# Altium schematic sheet Arduino_SLVN.SchDoc: Arduino-SLVN
size A4; Date: no entry; ApprovedBy: no entry; CheckedBy: no entry; Author: mattmue; CompanyName: ETH Zürich; DrawnBy: no entry; Engineer: no entry; Organization: ETH Zürich; Address1: Robotic Systems Lab; Address2: Leonhardstrasse 21; Address3: 8092 Zürich; Address4: Swizerland; DocumentNumber: no entry; Revision: 01; SheetNumber: 1; SheetTotal: 2; Time: no entry; ImagePath: no entry; Application_BuildNumber: no entry
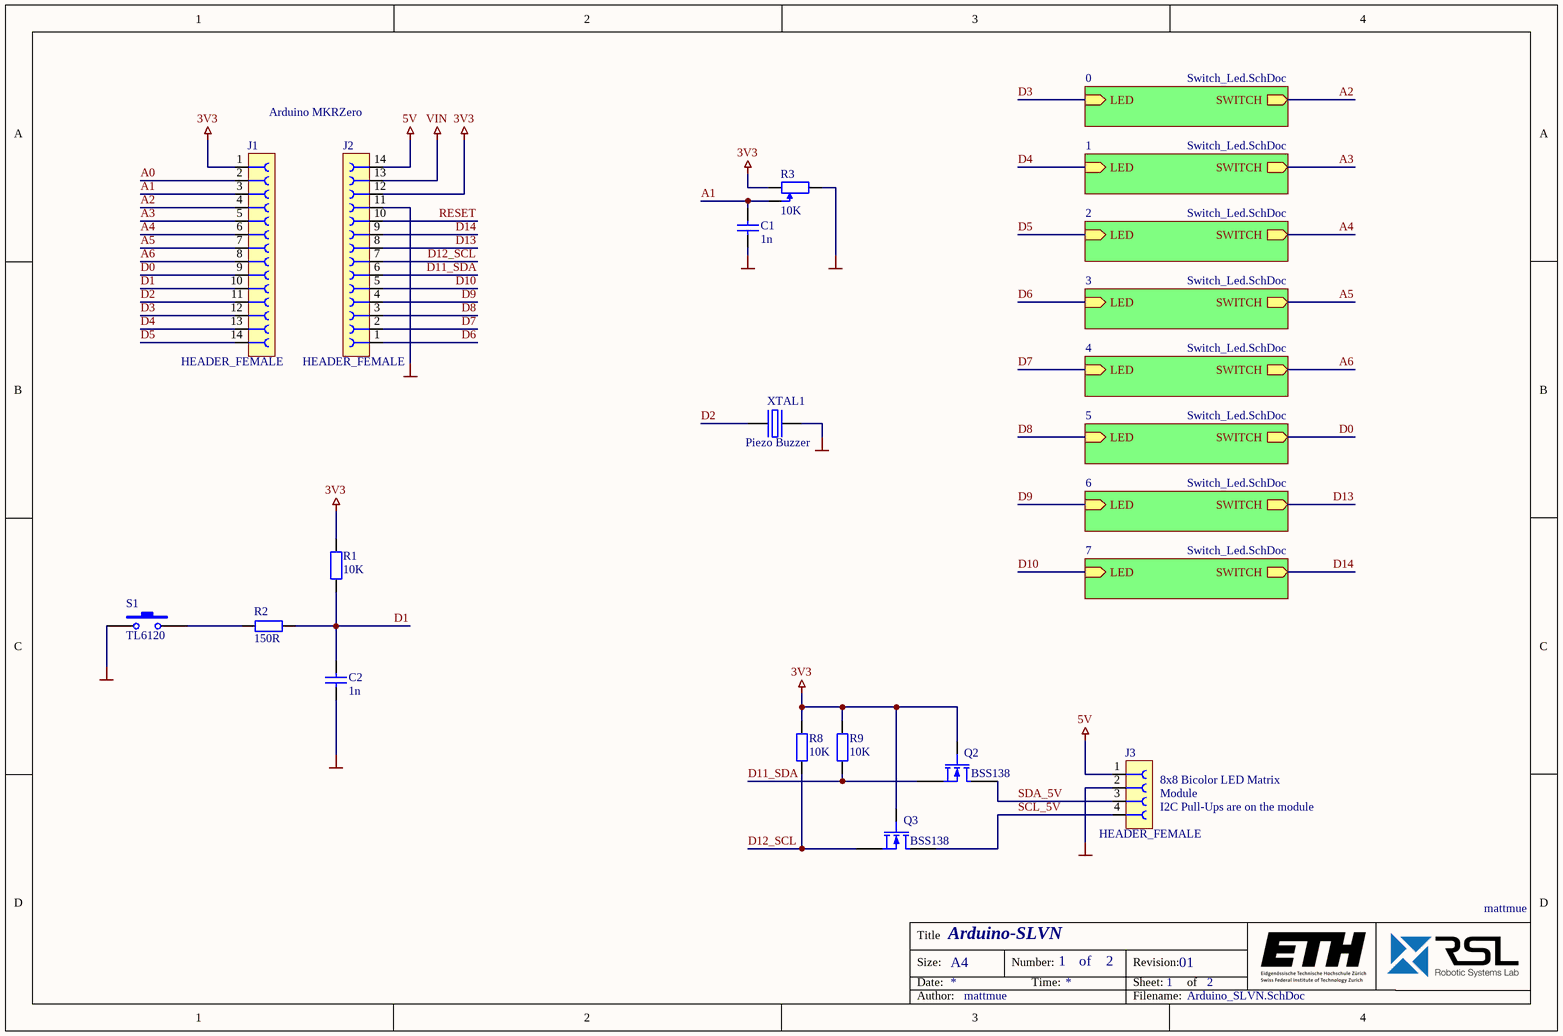
[diagram p0: Arduino_SLVN.SchDoc]

## Parts
C1  value 1n  [SMD_CAPC1608X08N]  (hidden comment: C0603)
C2  value 1n  [SMD_CAPC1608X08N]  (hidden comment: C0603)
J1  HEADER_FEMALE  [THT_CONN_1x14_FEMALE_2.54]
J2  HEADER_FEMALE  [THT_CONN_1x14_FEMALE_2.54]
J3  HEADER_FEMALE  [THT_CONN_1x4_FEMALE_2.54]
Q2  BSS138  [SOT323 SC70]
Q3  BSS138  [SOT323 SC70]
R1  value 10K  [SMD_RESC1608X05N]  (hidden comment: R0603)
R2  value 150R  [SMD_RESC1608X05N]  (hidden comment: R0603)
R3  value 10K  [THT_PTV09A-1]  (hidden comment: PTV09A-4020S-B103)
R8  value 10K  [SMD_RESC1608X05N]  (hidden comment: R0603)
R9  value 10K  [SMD_RESC1608X05N]  (hidden comment: R0603)
S1  TL6120  [SMD_TL6120]
sdfg1  Mattmue-Logo  [GRAPH_MATTMUE_6MM]  (value not drawn)  (no BOM)
XTAL1  Note: Piezo Buzzer  [THT_PIEZO_5mm]  (hidden comment: PS1240P02BT)

## Sub-sheets
0 = Switch_Led.SchDoc: LED (in), SWITCH (out)
1 = Switch_Led.SchDoc: LED (in), SWITCH (out)
2 = Switch_Led.SchDoc: LED (in), SWITCH (out)
3 = Switch_Led.SchDoc: LED (in), SWITCH (out)
4 = Switch_Led.SchDoc: LED (in), SWITCH (out)
5 = Switch_Led.SchDoc: LED (in), SWITCH (out)
6 = Switch_Led.SchDoc: LED (in), SWITCH (out)
7 = Switch_Led.SchDoc: LED (in), SWITCH (out)

## Nets
3V3: J1.1 J2.12 Q2.1(G) Q3.1(G) R1.2 R3.1 R8.2 R9.2
5V: J2.14 J3.1
GND: C1.1 C2.1 J2.11 J3.2 R3.2 S1.1 XTAL1.2
VIN: J2.13
A0: J1.2
A1: C1.2 J1.3 R3.3(TAP)
A2: J1.4 ; sheet 0/SWITCH
A3: J1.5 ; sheet 1/SWITCH
A4: J1.6 ; sheet 2/SWITCH
A5: J1.7 ; sheet 3/SWITCH
A6: J1.8 ; sheet 4/SWITCH
D0: J1.9 ; sheet 5/SWITCH
D1: C2.2 J1.10 R1.1 R2.1
D2: J1.11 XTAL1.1
D3: J1.12 ; sheet 0/LED
D4: J1.13 ; sheet 1/LED
D5: J1.14 ; sheet 2/LED
D6: J2.1 ; sheet 3/LED
D7: J2.2 ; sheet 4/LED
D8: J2.3 ; sheet 5/LED
D9: J2.4 ; sheet 6/LED
D10: J2.5 ; sheet 7/LED
D11_SDA: J2.6 Q2.2(S) R9.1
D12_SCL: J2.7 Q3.2(S) R8.1
D13: J2.8 ; sheet 6/SWITCH
D14: J2.9 ; sheet 7/SWITCH
RESET: J2.10
SCL_5V: J3.4 Q3.3(D)
SDA_5V: J3.3 Q2.3(D)
NetR2_2: R2.2 S1.2

## Notes on the sheet
- Arduino MKRZero
- (near J3) 8x8 Bicolor LED Matrix
- (near J3) I2C Pull-Ups are on the module
- (near J3) Module
- Title
- Size:
- Date:
- A4
- Number:
- Time:
- of
- Revision:
- Sheet:
- Author:
- Filename:
- (in symbol CMPL-001-0415-A.3) mattmue

## Library data of the parts
C1 C2 = CMP-02314-1: CERCAP 1n 100V 1% NP0/C0G 0603; Manufacturer: KEMET; Manufacturer Part Number: C0603C102F1GAC7867; Supplier: Digi-Key; Supplier Part Number: 399-17967-1-ND
J1 J2 = CMP-02128-2: CONN Female 1x14 2.54mm Straight THT 2.54x35.6mm; Manufacturer: Sullins Connector Solutions; Manufacturer Part Number: PPTC141LFBN-RC; Supplier Part Number: S7012-ND; Supplier: Digi-Key
J3 = CMP-02129-1: CONN Female 1x4 2.54mm Straight THT 2.54x10.16mm; Manufacturer: Sullins Connector Solutions; Manufacturer Part Number: PPTC041LFBN-RC; Supplier Part Number: S7002-ND; Supplier: Digi-Key
Q2 Q3 = CMP-01592-1: MOSFET N 0.2A 50V SOT323; Manufacturer2 Part Number: BSS138W-TP; Manufacturer: Diodes Incorporated; Manufacturer Part Number: BSS138W-7-F; Manufacturer2: Micro Commercial Co; Supplier2 Part Number: BSS138W-TPMSCT-ND; Supplier2: Digi-Key; Supplier Part Number: BSS138W-FDICT-ND; Supplier: Digi-Key
R1 R8 R9 = CMPL-001-0158-A.2: RES 10K 100mW 1% 0603; Manufacturer: YAEGO; Manufacturer Part Number: RC0603FR-0710KL; Manufacturer2 Part Number: CRCW060310K0FKEA; Manufacturer2: Vishay Dale; Supplier: Digi-Key; Supplier Part Number: 311-10.0KHRCT-ND; Supplier2: Digi-Key; Supplier2 Part Number: 541-10.0KHCT-ND
R2 = CMPL-001-0114-A.2: RES 150R 100mW 1% 0603; Manufacturer: YAEGO; Manufacturer Part Number: RC0603FR-07150RL; Manufacturer2 Part Number: CRCW0603150RFKEA; Manufacturer2: Vishay Dale; Supplier: Digi-Key; Supplier Part Number: 311-150HRCT-ND; Supplier2: Digi-Key; Supplier2 Part Number: 541-150HCT-ND
R3 = CMPL-001-0007-A.2: POTENTIOMETER 10K 50mW 20% 11x9.7mm; Manufacturer: Bourns Inc.; Note: Straight; Supplier: Digi-Key; Supplier Part Number: PTV09A-4020S-B103-ND; Manufacturer Part Number: PTV09A-4020S-B103
S1 = CMP-01596-1: BUTTON SPST 12V 0.05A 7.4x7.4mm; Manufacturer: E-Switch; Manufacturer Part Number: TL6120CF300QG; Supplier: Digi-Key; Supplier Part Number: EG4355CT-ND
sdfg1 = CMPL-001-0415-A.3: GRAPH MATTMUE
XTAL1 = CMPL-001-0432-2: PASSIVE PIEZO_BUZZER 12.6x7.8mm; Manufacturer: TDK Corporation; Supplier2 Part Number: 160; Supplier Part Number: 445-2525-1-ND; Manufacturer Part Number: PS1240P02BT; Supplier: Digi-Key; Supplier2: Adafruit